# EAGLE design xmas_tree_pcb_B (EAGLE 6.2)
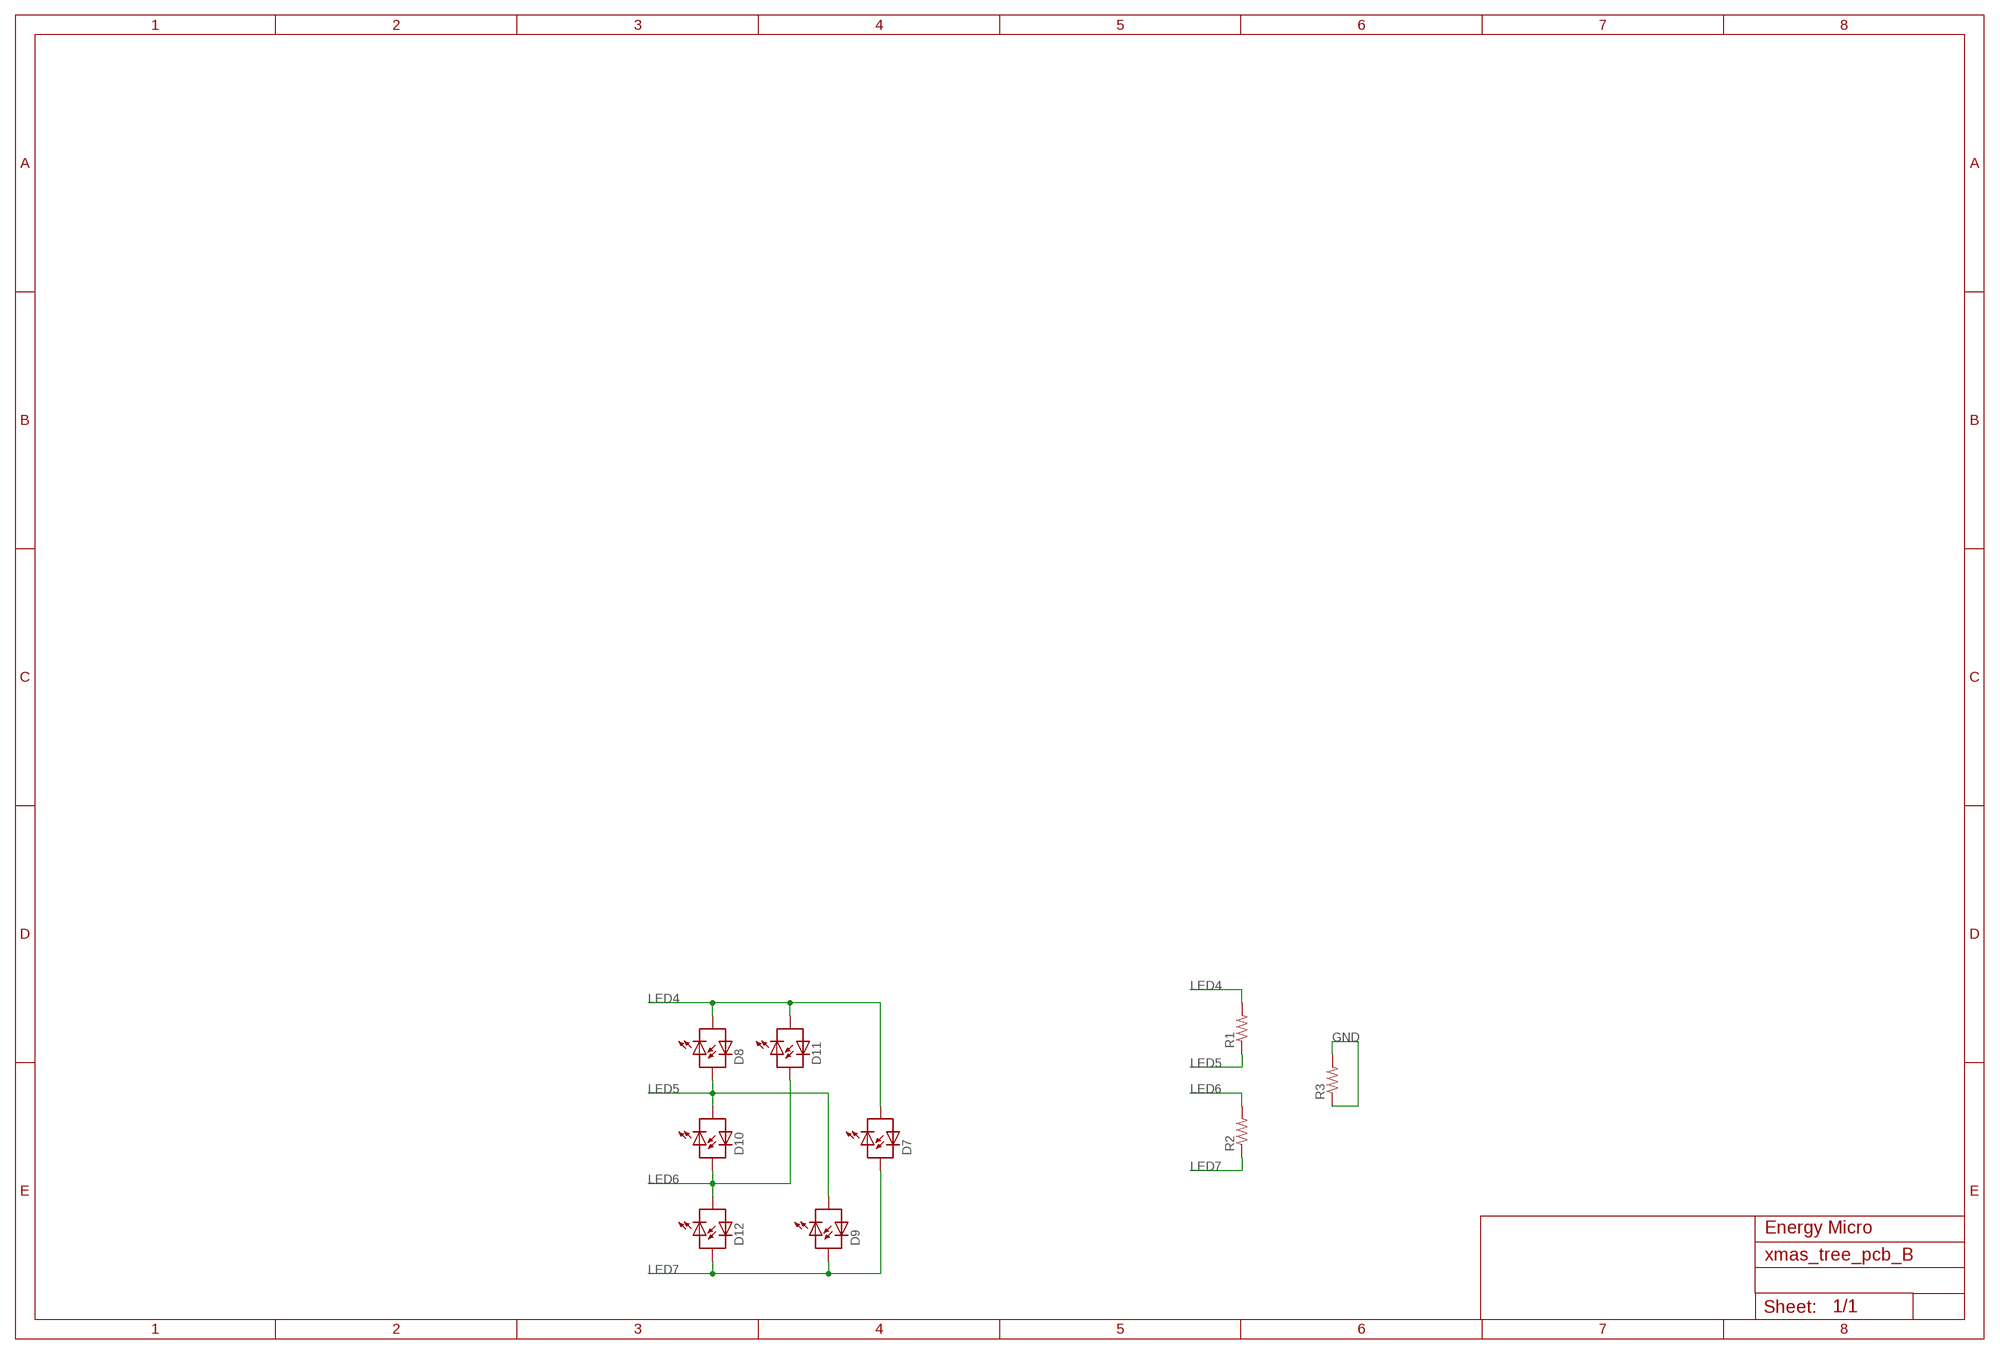
[diagram p0: schematic, sheet 1]

## Parts
D7  LED_BI_COLOR  [LED3MM]
D8  LED_BI_COLOR  [LED3MM]
D9  LED_BI_COLOR  [LED3MM]
D10  LED_BI_COLOR  [LED3MM]
D11  LED_BI_COLOR  [LED3MM]
D12  LED_BI_COLOR  [LED3MM]
R1  RESISTOR1206  [1206]
R2  RESISTOR1206  [1206]
R3  RESISTOR1206  [1206]

## Nets
GND: R3.1 R3.2
LED4: D7.K(C1) D8.K(C1) D11.K(C1) R1.2
LED5: D8.A(A1) D9.K(C1) D10.K(C1) R1.1
LED6: D10.A(A1) D11.A(A1) D12.K(C1) R2.2
LED7: D7.A(A1) D9.A(A1) D12.A(A1) R2.1

## Notes on the sheet
- Energy Micro

## Library data of the parts
D7-D12 = SparkFun_mod:LED_BI_COLOR
R1-R3 = SparkFun_mod:RESISTOR: Resistor Basic schematic elements and footprints for 0603, 1206, and PTH 1/10th watt (small) resistors.

## Board
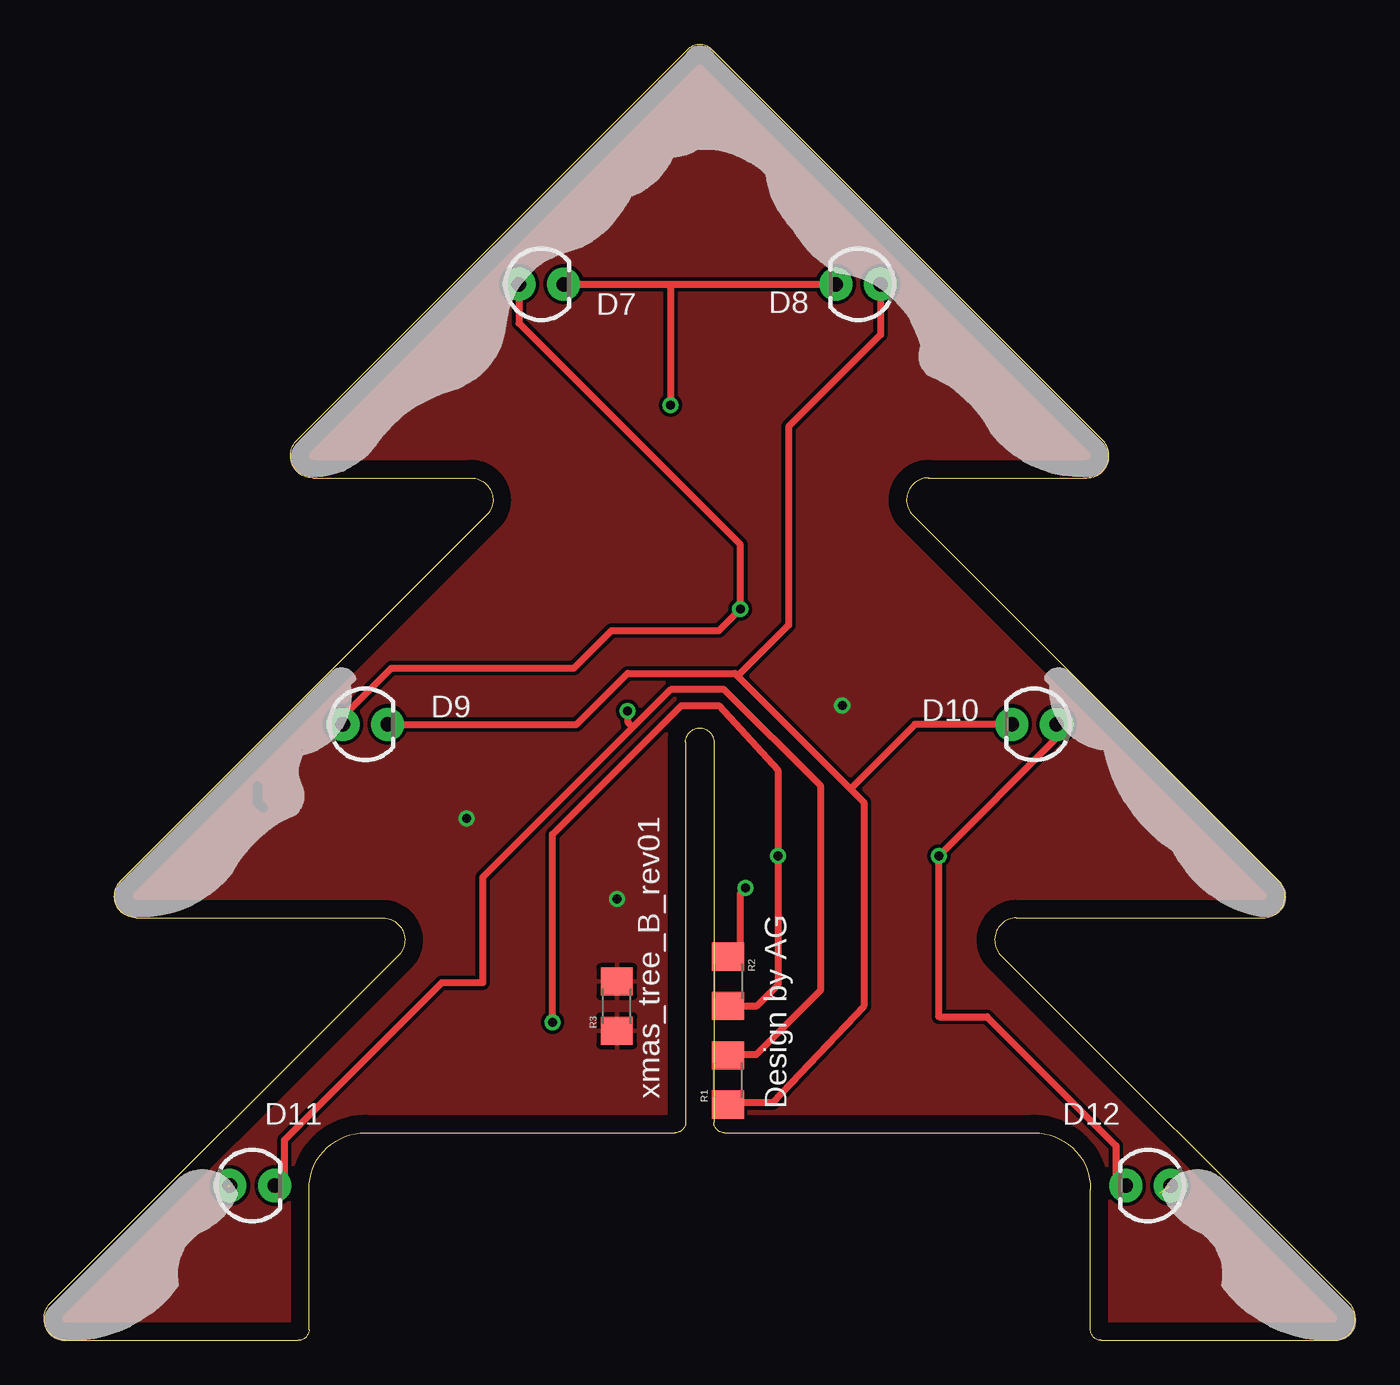
[diagram p1: board, top side]
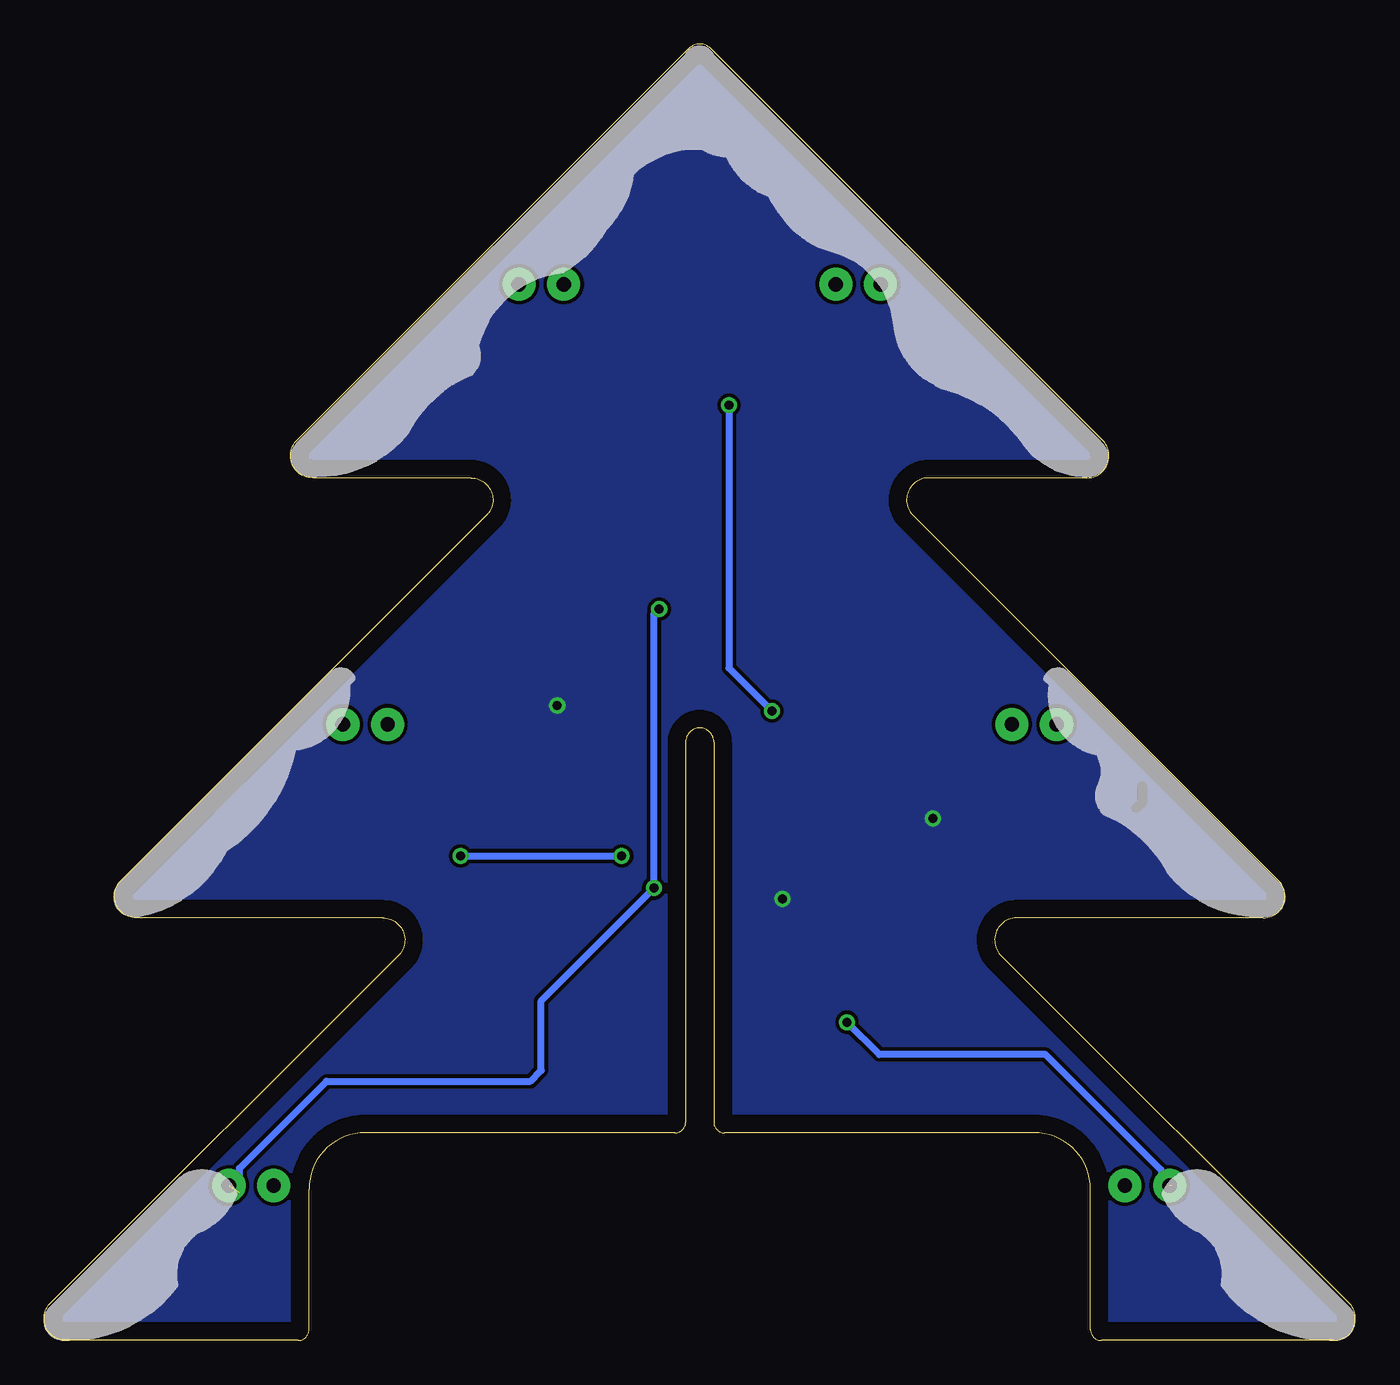
[diagram p2: board, bottom side, seen from below]

Size 74.5 x 73.65 mm. Coordinates in mm from the lower left corner, seen from the top.
Outline: 55.25,24 69.25,24 arc127 70.25,26 49.25,47 arc-127 50.25,49 59.25,49 arc127 60.25,51 37.85,73.4 arc90 36.65,73.4 14.25,51 arc127 15.25,49 24.25,49 arc-127 25.25,47 4.25,26 arc127 5.25,24 19.25,24 arc-127 20.25,22 0.25,2 arc127 1.25,0 14.45,0 arc90 15.05,0.6 15.05,8.6 arc-90 18.25,11.8 35.85,11.8 arc90 36.45,12.4 36.45,34 arc-180 38.05,34 38.05,12.4 arc90 38.65,11.8 56.25,11.8 arc-90 59.45,8.6 59.45,0.6 arc90 60.05,0 73.25,0 arc127 74.25,2 54.25,22 arc-127 55.25,24
Copper layers (1*16): Top 0.035mm / dielectric 1.5mm / Bottom 0.035mm
Design rules: minimum track width 10mil, minimum drill 20mil, track to track 8mil, track to pad 8mil, pad to pad 6mil, via to via 8mil, smd to smd 6mil, copper to edge 40mil, drill to drill 8mil, minimum pad ring 10mil, minimum via ring 8mil, stop-mask expansion 4mil, vias tented up to drill 20mil, thermal gap 10mil
tRestrict: 2 lines
bRestrict: 2 lines

### Footprints (pad centres in the part's own frame; a part is rotated, then mirrored left to right if it is on the bottom)
LED3MM = drill 0.813 pad 1.88: A -1.27,0; K 1.27,0
1206 = smd 1.6 x 1.8: 1 -1.4,0; 2 1.4,0

### Placement (x,y rotation side)
D7  28.25,60 0 top
D8  46.25,60 180 top
D9  18.25,35 0 top
D10  56.25,35 180 top
D11  11.83,8.8 0 top
D12  62.72,8.8 180 top
R1  38.85,14.8 90 top
R2  38.85,20.4 270 top
R3  32.54,18.99 90 top

### Tracks (layer width: path | path; a pad name or v marks a point on that pad's centre or on a via)
GND  (via drill 0.51)
  other vias: 32.54,25.09 24.01,29.66 45.34,36.06
  pour Top (isolate 0.152): -0.68,-1.12 -0.68,75.03 75.82,75.03 75.82,-1.12
  pour Bottom (isolate 0.152): -0.68,-0.82 75.82,-0.82 75.82,75.14 -0.68,75.14
LED4  (via drill 0.51)
  Top 0.406: R1.2 38.8,16.25 40.47,16.25 44.12,19.91 44.12,31.49 38.64,36.98 35.59,36.98 33.46,34.84 | D8.K D7.K 35.43,60 35.59,59.84 v35.59,53.13 | 33.46,34.84 24.92,26.31 24.92,20.33 22.6,20.33 13.64,11.37 13.64,9.45 D11.K | v33.15,35.76 33.15,35.15 33.46,34.84
  Bottom 0.406: v35.59,53.13 35.59,38.2 v33.15,35.76
LED5
  Top 0.406: 38.74,13.51 R1.1 38.96,13.51 41.38,13.51 46.56,18.99 46.56,30.58 45.8,31.34 | D9.K 30.26,35 33.15,37.89 39.25,37.89 39.4,37.74 | 39.4,37.74 45.8,31.34 | D8.A 47.52,57.14 42.3,51.91 42.3,40.63 39.4,37.74 | D10.K 49.46,35 45.8,31.34
LED6  (via drill 0.51)  (1 unrouted)
  Top 0.406: v28.88,18.08 28.88,28.75 36.2,36.06 38.33,36.06 41.69,32.41 v41.69,27.53 41.69,20.21 40.47,18.99 R2.2 | D10.A 57.52,34.22 v50.83,27.53 50.83,18.38 53.57,18.38 60.89,11.07 60.89,9.37 D12.K
  Bottom 0.406: v50.83,27.53 v41.69,27.53 | 10.45,8.78 11.06,9.7 17.61,16.25 27.06,16.25 v28.88,18.08
LED7  (via drill 0.51)  (1 unrouted)
  Top 0.406: D7.A 26.98,57.78 39.55,45.21 v39.55,41.55 38.33,40.33 32.24,40.33 30.1,38.2 19.74,38.2 16.98,35.44 D9.A | R2.1 39.55,22.5 39.55,25.39 v39.86,25.7
  Bottom 0.406: v39.55,41.55 39.86,41.24 v39.86,25.7 46.26,19.3 46.26,15.34 46.87,14.73 58.45,14.73 63.39,9.78 63.39,8.39

### Text on the board
_tsilk: xmas_tree_B_rev01 | Design by AG